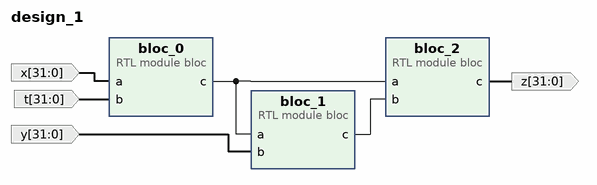
[diagram p0: block diagram of the top level]
# Vivado block design design_1, xc7a100tcsg324-1, Vivado 2022.1
create_bd_design design_1

create_bd_port -dir I -from 31 -to 0 t
create_bd_port -dir I -from 31 -to 0 x
create_bd_port -dir I -from 31 -to 0 y
create_bd_port -dir O -from 31 -to 0 z

create_bd_cell -type module -reference bloc bloc_0
create_bd_cell -type module -reference bloc bloc_1
create_bd_cell -type module -reference bloc bloc_2

# ---- connections ----

connect_bd_net -net a_0_1 [get_bd_ports x] [get_bd_pins bloc_0/a]
connect_bd_net -net b_0_1 [get_bd_ports t] [get_bd_pins bloc_0/b]
connect_bd_net -net b_1_1 [get_bd_ports y] [get_bd_pins bloc_1/b]
connect_bd_net [get_bd_pins bloc_0/c] [get_bd_pins bloc_1/a] [get_bd_pins bloc_2/a]
connect_bd_net [get_bd_pins bloc_1/c] [get_bd_pins bloc_2/b]
connect_bd_net [get_bd_pins bloc_2/c] [get_bd_ports z]

validate_bd_design
save_bd_design
